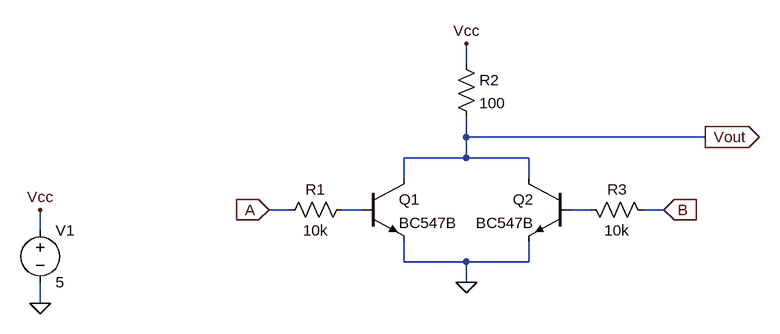
[diagram p0: schematic NORgate.asc]
NORgate.asc, the LTspice schematic file:
Version 4
SHEET 1 880 680
WIRE 320 -48 320 -80
WIRE 320 64 320 32
WIRE 688 64 320 64
WIRE 320 96 320 64
WIRE 320 96 224 96
WIRE 416 96 320 96
WIRE 224 128 224 96
WIRE 416 128 416 96
WIRE 48 176 16 176
WIRE 160 176 128 176
WIRE 512 176 480 176
WIRE 624 176 592 176
WIRE -336 208 -336 176
WIRE 224 256 224 224
WIRE 320 256 224 256
WIRE 416 256 416 224
WIRE 416 256 320 256
WIRE 320 288 320 256
WIRE -336 320 -336 288
FLAG 320 288 0
FLAG -336 320 0
FLAG -336 176 Vcc
FLAG 320 -80 Vcc
FLAG 16 176 A
IOPIN 16 176 In
FLAG 624 176 B
IOPIN 624 176 In
FLAG 688 64 Vout
IOPIN 688 64 Out
SYMBOL npn 160 128 R0
SYMATTR InstName Q1
SYMATTR Value BC547B
SYMBOL res 144 160 R90
WINDOW 0 0 56 VBottom 2
WINDOW 3 32 56 VTop 2
SYMATTR InstName R1
SYMATTR Value 10k
SYMBOL res 304 -64 R0
SYMATTR InstName R2
SYMATTR Value 100
SYMBOL npn 480 128 M0
SYMATTR InstName Q2
SYMATTR Value BC547B
SYMBOL res 496 160 M90
WINDOW 0 0 56 VBottom 2
WINDOW 3 32 56 VTop 2
SYMATTR InstName R3
SYMATTR Value 10k
SYMBOL voltage -336 192 R0
WINDOW 123 0 0 Left 0
WINDOW 39 0 0 Left 0
SYMATTR InstName V1
SYMATTR Value 5

The netlist it stands for:
* NORgate.asc
Q1 Vout N001 0 0 BC547B
R1 N001 A 10k
R2 Vcc Vout 100
Q2 Vout N002 0 0 BC547B
R3 N002 B 10k
V1 Vcc 0 5
.model NPN NPN
.model PNP PNP
.lib standard.bjt
.backanno
.end